# EAGLE design Board (EAGLE 9.3.0)

## Sheet 1 of 2
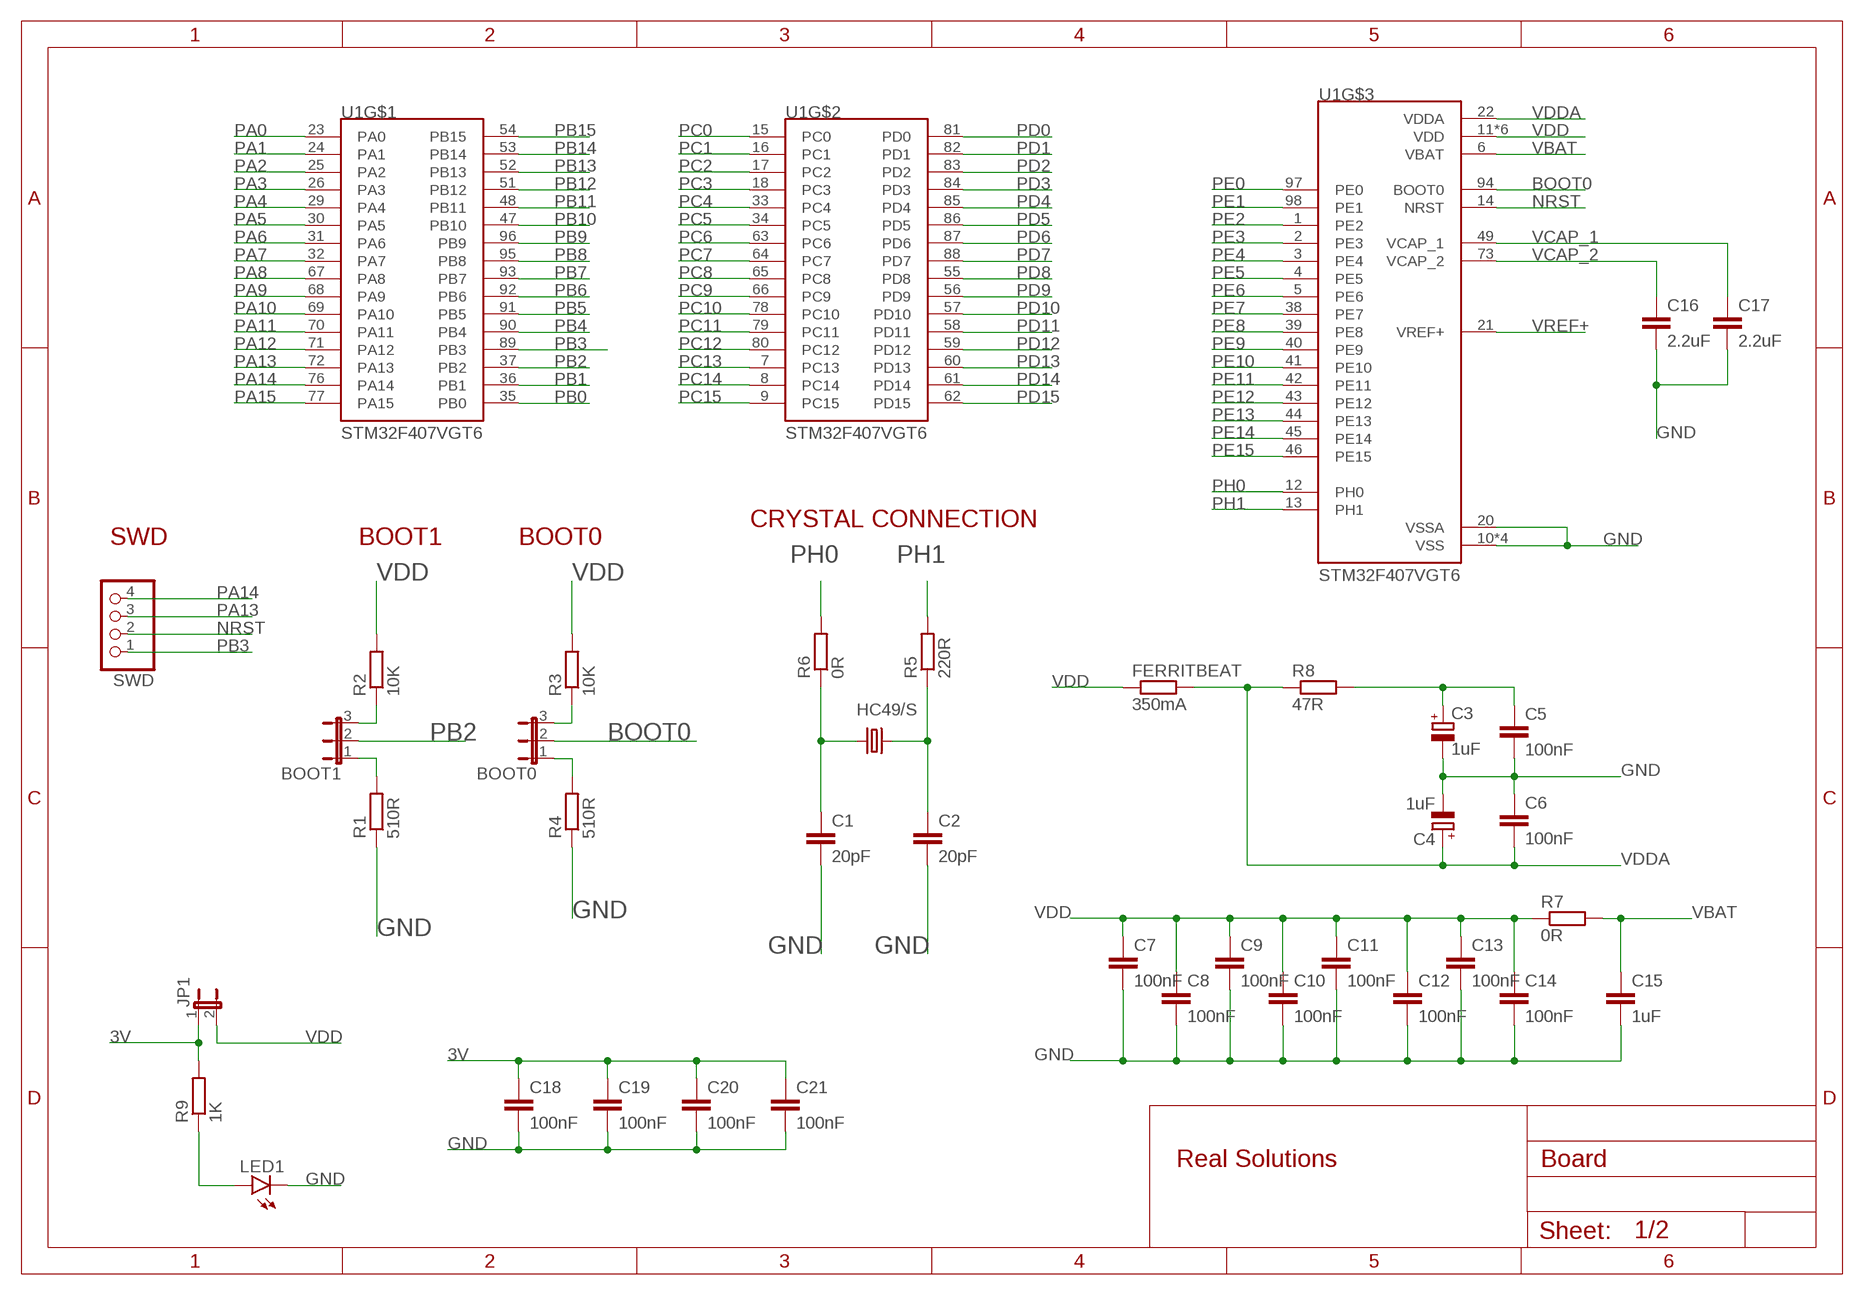
[diagram p0: schematic, sheet 1]

### Parts
BOOT0  JP2E  [JP2]
BOOT1  JP2E  [JP2]
C1  20pF  C-EUC0805  [C0805]
C2  20pF  C-EUC0805  [C0805]
C3  1uF  CPOL-EUSMCA  [SMC_A]
C4  1uF  CPOL-EUSMCA  [SMC_A]
C5  100nF  C-EUC0805  [C0805]
C6  100nF  C-EUC0805  [C0805]
C7  100nF  C-EUC0805  [C0805]
C8  100nF  C-EUC0805  [C0805]
C9  100nF  C-EUC0805  [C0805]
C10  100nF  C-EUC0805  [C0805]
C11  100nF  C-EUC0805  [C0805]
C12  100nF  C-EUC0805  [C0805]
C13  100nF  C-EUC0805  [C0805]
C14  100nF  C-EUC0805  [C0805]
C15  1uF  C-EUC0805  [C0805]
C16  2.2uF  C-EUC0805  [C0805]
C17  2.2uF  C-EUC0805  [C0805]
C18  100nF  C-EUC0805  [C0805]
C19  100nF  C-EUC0805  [C0805]
C20  100nF  C-EUC0805  [C0805]
C21  100nF  C-EUC0805  [C0805]
FERRITBEAT  350mA  R-EU_R1206  [R1206]
HC49/S  CRYSTALHC49S  [HC49/S]
JP1  JP1E  [JP1]
LED1  LEDCHIP-LED0805  [CHIP-LED0805]
R1  510R  R-EU_R0805  [R0805]
R2  10K  R-EU_R0805  [R0805]
R3  10K  R-EU_R0805  [R0805]
R4  510R  R-EU_R0805  [R0805]
R5  220R  R-EU_R0805  [R0805]
R6  0R  R-EU_R0805  [R0805]
R7  0R  R-EU_R0805  [R0805]
R8  47R  R-EU_R0805  [R0805]
R9  1K  R-EU_R0805  [R0805]
SWD  PINHD-1X4  [1X04]
U1  STM32F407VGT6  [QFP50P1600X1600X160-100N]

### Nets
3V: C18.1 C19.1 C20.1 C21.1 JP1.1 R9.2 ; also sheet 2
BOOT0: BOOT0.2 U1.94(BOOT0)
GND: C1.2 C2.2 C3.- C4.- C5.2 C6.1 C7.2 C8.2 C9.2 C10.2 C11.2 C12.2 C13.2 C14.2 C15.2 C16.2 C17.2 C18.2 C19.2 C20.2 C21.2 LED1.C R1.1 R4.1 U1.10(VSS) U1.20(VSSA) U1.27(VSS) U1.74(VSS) U1.99(VSS) ; also sheet 2
N$1: C1.1 HC49/S.1 R6.1
N$2: C2.1 HC49/S.2 R5.1
N$3: BOOT1.3 R2.1
N$4: BOOT1.1 R1.2
N$5: BOOT0.3 R3.1
N$6: BOOT0.1 R4.2
N$7: LED1.A R9.1
N$8: C3.+ C5.1 R8.2
NRST: SWD.2 U1.14(NRST) ; also sheet 2
PA0: U1.23(PA0) ; also sheet 2
PA1: U1.24(PA1) ; also sheet 2
PA2: U1.25(PA2) ; also sheet 2
PA3: U1.26(PA3) ; also sheet 2
PA4: U1.29(PA4) ; also sheet 2
PA5: U1.30(PA5) ; also sheet 2
PA6: U1.31(PA6) ; also sheet 2
PA7: U1.32(PA7) ; also sheet 2
PA8: U1.67(PA8) ; also sheet 2
PA9: U1.68(PA9) ; also sheet 2
PA10: U1.69(PA10) ; also sheet 2
PA11: U1.70(PA11) ; also sheet 2
PA12: U1.71(PA12) ; also sheet 2
PA13: SWD.3 U1.72(PA13) ; also sheet 2
PA14: SWD.4 U1.76(PA14) ; also sheet 2
PA15: U1.77(PA15) ; also sheet 2
PB0: U1.35(PB0) ; also sheet 2
PB1: U1.36(PB1) ; also sheet 2
PB2: BOOT1.2 U1.37(PB2) ; also sheet 2
PB3: SWD.1 U1.89(PB3) ; also sheet 2
PB4: U1.90(PB4) ; also sheet 2
PB5: U1.91(PB5) ; also sheet 2
PB6: U1.92(PB6) ; also sheet 2
PB7: U1.93(PB7) ; also sheet 2
PB8: U1.95(PB8) ; also sheet 2
PB9: U1.96(PB9) ; also sheet 2
PB10: U1.47(PB10) ; also sheet 2
PB11: U1.48(PB11) ; also sheet 2
PB12: U1.51(PB12) ; also sheet 2
PB13: U1.52(PB13) ; also sheet 2
PB14: U1.53(PB14) ; also sheet 2
PB15: U1.54(PB15) ; also sheet 2
PC0: U1.15(PC0) ; also sheet 2
PC1: U1.16(PC1) ; also sheet 2
PC2: U1.17(PC2) ; also sheet 2
PC3: U1.18(PC3) ; also sheet 2
PC4: U1.33(PC4) ; also sheet 2
PC5: U1.34(PC5) ; also sheet 2
PC6: U1.63(PC6) ; also sheet 2
PC7: U1.64(PC7) ; also sheet 2
PC8: U1.65(PC8) ; also sheet 2
PC9: U1.66(PC9) ; also sheet 2
PC10: U1.78(PC10) ; also sheet 2
PC11: U1.79(PC11) ; also sheet 2
PC12: U1.80(PC12) ; also sheet 2
PC13: U1.7(PC13) ; also sheet 2
PC14: U1.8(PC14) ; also sheet 2
PC15: U1.9(PC15) ; also sheet 2
PD0: U1.81(PD0) ; also sheet 2
PD1: U1.82(PD1) ; also sheet 2
PD2: U1.83(PD2) ; also sheet 2
PD3: U1.84(PD3) ; also sheet 2
PD4: U1.85(PD4) ; also sheet 2
PD5: U1.86(PD5) ; also sheet 2
PD6: U1.87(PD6) ; also sheet 2
PD7: U1.88(PD7) ; also sheet 2
PD8: U1.55(PD8) ; also sheet 2
PD9: U1.56(PD9) ; also sheet 2
PD10: U1.57(PD10) ; also sheet 2
PD11: U1.58(PD11) ; also sheet 2
PD12: U1.59(PD12) ; also sheet 2
PD13: U1.60(PD13) ; also sheet 2
PD14: U1.61(PD14) ; also sheet 2
PD15: U1.62(PD15) ; also sheet 2
PE0: U1.97(PE0) ; also sheet 2
PE1: U1.98(PE1) ; also sheet 2
PE2: U1.1(PE2) ; also sheet 2
PE3: U1.2(PE3) ; also sheet 2
PE4: U1.3(PE4) ; also sheet 2
PE5: U1.4(PE5) ; also sheet 2
PE6: U1.5(PE6) ; also sheet 2
PE7: U1.38(PE7) ; also sheet 2
PE8: U1.39(PE8) ; also sheet 2
PE9: U1.40(PE9) ; also sheet 2
PE10: U1.41(PE10) ; also sheet 2
PE11: U1.42(PE11) ; also sheet 2
PE12: U1.43(PE12) ; also sheet 2
PE13: U1.44(PE13) ; also sheet 2
PE14: U1.45(PE14) ; also sheet 2
PE15: U1.46(PE15) ; also sheet 2
PH0: R6.2 U1.12(PH0)
PH1: R5.2 U1.13(PH1)
VBAT: C15.1 R7.2 U1.6(VBAT)
VCAP_1: C17.1 U1.49(VCAP_1)
VCAP_2: C16.1 U1.73(VCAP_2)
VDD: C7.1 C8.1 C9.1 C10.1 C11.1 C12.1 C13.1 C14.1 FERRITBEAT.1 JP1.2 R2.2 R3.2 R7.1 U1.11(VDD) U1.19(VDD) U1.28(VDD) U1.50(VDD) U1.75(VDD) U1.100(VDD) ; also sheet 2
VDDA: C4.+ C6.2 FERRITBEAT.2 R8.1 U1.22(VDDA)
VREF+: U1.21(VREF+)

### Notes on the sheet
- CRYSTAL CONNECTION
- SWD | BOOT1 | BOOT0
- Real Solutions

## Sheet 2 of 2
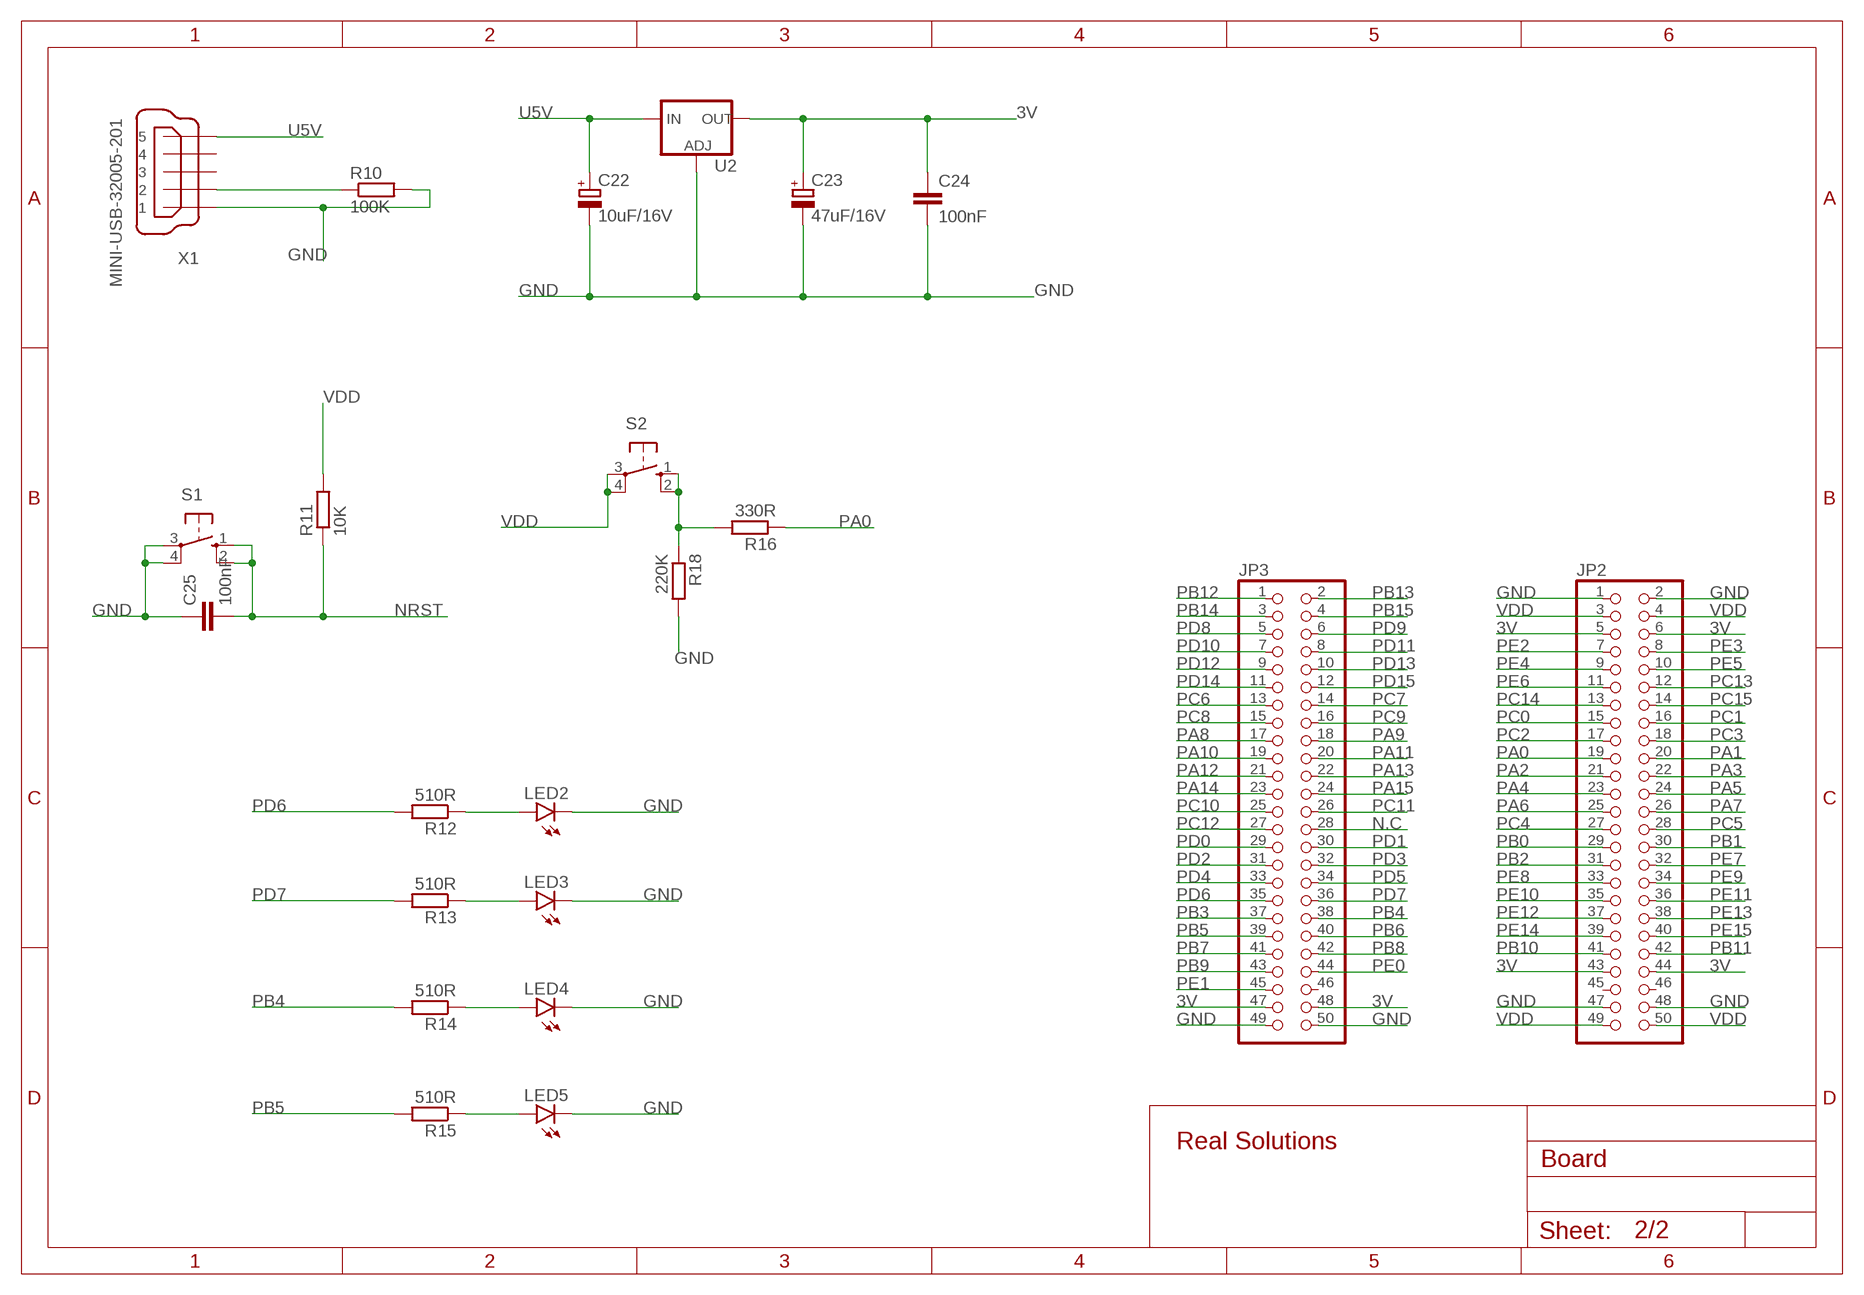
[diagram p1: schematic, sheet 2]

### Parts
C22  10uF/16V  CPOL-EU153CLV-0405  [153CLV-0405]
C23  47uF/16V  CPOL-EU153CLV-0605  [153CLV-0605]
C24  100nF  C-EUC0805  [C0805]
C25  100nF  C-EUC0805  [C0805]
JP2  PINHD-2X25  [2X25]
JP3  PINHD-2X25  [2X25]
LED2  LEDCHIP-LED0805  [CHIP-LED0805]
LED3  LEDCHIP-LED0805  [CHIP-LED0805]
LED4  LEDCHIP-LED0805  [CHIP-LED0805]
LED5  LEDCHIP-LED0805  [CHIP-LED0805]
R10  100K  R-EU_R0805  [R0805]
R11  10K  R-EU_R0805  [R0805]
R12  510R  R-EU_R0805  [R0805]
R13  510R  R-EU_R0805  [R0805]
R14  510R  R-EU_R0805  [R0805]
R15  510R  R-EU_R0805  [R0805]
R16  330R  R-EU_R0805  [R0805]
R18  220K  R-EU_R0805  [R0805]
S1  10-XX  [B3F-10XX]
S2  10-XX  [B3F-10XX]
U2  V_REG_LM1117SOT223  [SOT223]
X1  MINI-USB-32005-201  [32005-201]

### Nets
3V: C23.+ C24.1 JP2.5 JP2.6 JP2.43 JP2.44 JP3.47 JP3.48 U2.2(OUT) U2.4(OUT) ; also sheet 1
GND: C22.- C23.- C24.2 C25.1 JP2.1 JP2.2 JP2.47 JP2.48 JP3.49 JP3.50 LED2.C LED3.C LED4.C LED5.C R10.2 R18.2 S1.3(P) S1.4(P1) U2.1(ADJ) X1.1 ; also sheet 1
N$9: LED2.A R12.1
N$10: LED3.A R13.1
N$11: LED4.A R14.1
N$12: R10.1 X1.2
N$13: LED5.A R15.1
N$15: R16.2 R18.1 S2.1(S) S2.2(S1)
N.C: JP3.28
NRST: C25.2 R11.1 S1.1(S) S1.2(S1) ; also sheet 1
PA0: JP2.19 R16.1 ; also sheet 1
PA1: JP2.20 ; also sheet 1
PA2: JP2.21 ; also sheet 1
PA3: JP2.22 ; also sheet 1
PA4: JP2.23 ; also sheet 1
PA5: JP2.24 ; also sheet 1
PA6: JP2.25 ; also sheet 1
PA7: JP2.26 ; also sheet 1
PA8: JP3.17 ; also sheet 1
PA9: JP3.18 ; also sheet 1
PA10: JP3.19 ; also sheet 1
PA11: JP3.20 ; also sheet 1
PA12: JP3.21 ; also sheet 1
PA13: JP3.22 ; also sheet 1
PA14: JP3.23 ; also sheet 1
PA15: JP3.24 ; also sheet 1
PB0: JP2.29 ; also sheet 1
PB1: JP2.30 ; also sheet 1
PB2: JP2.31 ; also sheet 1
PB3: JP3.37 ; also sheet 1
PB4: JP3.38 R14.2 ; also sheet 1
PB5: JP3.39 R15.2 ; also sheet 1
PB6: JP3.40 ; also sheet 1
PB7: JP3.41 ; also sheet 1
PB8: JP3.42 ; also sheet 1
PB9: JP3.43 ; also sheet 1
PB10: JP2.41 ; also sheet 1
PB11: JP2.42 ; also sheet 1
PB12: JP3.1 ; also sheet 1
PB13: JP3.2 ; also sheet 1
PB14: JP3.3 ; also sheet 1
PB15: JP3.4 ; also sheet 1
PC0: JP2.15 ; also sheet 1
PC1: JP2.16 ; also sheet 1
PC2: JP2.17 ; also sheet 1
PC3: JP2.18 ; also sheet 1
PC4: JP2.27 ; also sheet 1
PC5: JP2.28 ; also sheet 1
PC6: JP3.13 ; also sheet 1
PC7: JP3.14 ; also sheet 1
PC8: JP3.15 ; also sheet 1
PC9: JP3.16 ; also sheet 1
PC10: JP3.25 ; also sheet 1
PC11: JP3.26 ; also sheet 1
PC12: JP3.27 ; also sheet 1
PC13: JP2.12 ; also sheet 1
PC14: JP2.13 ; also sheet 1
PC15: JP2.14 ; also sheet 1
PD0: JP3.29 ; also sheet 1
PD1: JP3.30 ; also sheet 1
PD2: JP3.31 ; also sheet 1
PD3: JP3.32 ; also sheet 1
PD4: JP3.33 ; also sheet 1
PD5: JP3.34 ; also sheet 1
PD6: JP3.35 R12.2 ; also sheet 1
PD7: JP3.36 R13.2 ; also sheet 1
PD8: JP3.5 ; also sheet 1
PD9: JP3.6 ; also sheet 1
PD10: JP3.7 ; also sheet 1
PD11: JP3.8 ; also sheet 1
PD12: JP3.9 ; also sheet 1
PD13: JP3.10 ; also sheet 1
PD14: JP3.11 ; also sheet 1
PD15: JP3.12 ; also sheet 1
PE0: JP3.44 ; also sheet 1
PE1: JP3.45 ; also sheet 1
PE2: JP2.7 ; also sheet 1
PE3: JP2.8 ; also sheet 1
PE4: JP2.9 ; also sheet 1
PE5: JP2.10 ; also sheet 1
PE6: JP2.11 ; also sheet 1
PE7: JP2.32 ; also sheet 1
PE8: JP2.33 ; also sheet 1
PE9: JP2.34 ; also sheet 1
PE10: JP2.35 ; also sheet 1
PE11: JP2.36 ; also sheet 1
PE12: JP2.37 ; also sheet 1
PE13: JP2.38 ; also sheet 1
PE14: JP2.39 ; also sheet 1
PE15: JP2.40 ; also sheet 1
U5V: C22.+ U2.3(IN) X1.5
VDD: JP2.3 JP2.4 JP2.49 JP2.50 R11.2 S2.3(P) S2.4(P1) ; also sheet 1
Unconnected: JP2.45 JP2.46 JP3.46 X1.3 X1.4

### Notes on the sheet
- Real Solutions

## Library data of the parts
BOOT0 BOOT1 = jumper:JP2E: JUMPER
C1 C2 C5-C21 C24 C25 = rcl:C-EU: CAPACITOR, European symbol; SPICEPREFIX: C
C3 C4 C22 C23 = rcl:CPOL-EU: POLARIZED CAPACITOR, European symbol; SPICEPREFIX: C
FERRITBEAT R1-R16 R18 = rcl:R-EU_: RESISTOR, European symbol; SPICEPREFIX: R
HC49/S = crystal:CRYSTAL: CRYSTAL; OC_FARNELL: 1667008; OC_NEWARK: unknown
JP1 = jumper:JP1E: JUMPER
JP2 JP3 = pinhead:PINHD-2X25: PIN HEADER
LED1-LED5 = led:LED: LED OSRAM: - CHIPLED LG R971, LG N971, LY N971, LG Q971, LY Q971, LO R971, LY R971 LH N974, LH R974 LS Q976, LO Q976, LY Q976 LO Q996 - Hyper CHIPLED LW Q18S LB Q993, LB Q99A, LB R99A - SideLED LS A670, LO A670, LY A670, LG A670, LP A670 LB A673, LV A673, LT A673, LW A673 LH A674 LY A675 LS A676, LA A676, LO A676, LY A676, LW A676 LS A679, LY A679, LG A679 - Hyper Micro SIDELED® LS Y876, LA Y876, LO Y876, LY Y876 LT Y87S - SmartLED LW L88C, LW L88S LB L89C, LB L89S, LG L890 LS L89K, LO L89K, LY L89K LS L896, LA L896, LO L896, LY L896 - TOPLED LS T670, LO T670, LY T670, LG T670, LP T670 LSG T670, LSP T670, LSY T670, LOP T670, LYG T670 LG T671, LOG T671, LSG T671 LB T673, LV T673, LT T673, LW T673 LH T674 LS T676, LA T676, LO T676, LY T676, LB T676, LH T676, LSB T676, LW T676 LB T67C, LV T67C, LT T67C, LS T67K, LO T67K, LY T67K, LW E67C LS E67B, LA E67B, LO E67B, LY E67B, LB E67C, LV E67C, LT E67C LW T67C LS T679, LY T679, LG T679 LS T770, LO T770, LY T770, LG T770, LP T770 LB T773, LV T773, LT T773, LW T773 LH T774 LS E675, LA E675, LY E675, LS T675 LS T776, LA T776, LO T776, LY T776, LB T776 LHGB T686 LT T68C, LB T68C - Hyper Mini TOPLED® LB M676 - Mini TOPLED Santana® LG M470 LS M47K, LO M47K, LY M47K Source: http://www.osram.convergy.de LUXEON: - LUMILED® LXK2-PW12-R00, LXK2-PW12-S00, LXK2-PW14-U00, LXK2-PW14-V00 LXK2-PM12-R00, LXK2-PM12-S00, LXK2-PM14-U00 LXK2-PE12-Q00, LXK2-PE12-R00, LXK2-PE12-S00, LXK2-PE14-T00, LXK2-PE14-U00 LXK2-PB12-K00, LXK2-PB12-L00, LXK2-PB12-M00, LXK2-PB14-N00, LXK2-PB14-P00, LXK2-PB14-Q00 LXK2-PR12-L00, LXK2-PR12-M00, LXK2-PR14-Q00, LXK2-PR14-R00 LXK2-PD12-Q00, LXK2-PD12-R00, LXK2-PD12-S00 LXK2-PH12-R00, LXK2-PH12-S00 LXK2-PL12-P00, LXK2-PL12-Q00, LXK2-PL12-R00 Source: www.luxeon.com KINGBRIGHT: KA-3528ASYC Source: www.kingbright.com
S1 S2 = switch-omron:10-XX: OMRON SWITCH; MPN: B3F-1000; OC_FARNELL: 176432; OC_NEWARK: 36M3542
SWD = pinhead:PINHD-1X4: PIN HEADER
U1 = STM32F407VGT6:STM32F407VGT6: STM32 Series 32-bit 1 MB Flash 192 kB RAM ARM Based Microcontroller - LQFP-100; AVAILABILITY: Unavailable; DESCRIPTION: ARM® Cortex®-M4 STM32F4 Microcontroller IC 32-Bit 168MHz 1MB _1M x 8_ FLASH 100-LQFP _14x14_; MF: STMicroelectronics; MP: STM32F407VGT6; PACKAGE: LQFP-100 STMicroelectronics; PRICE: None
U2 = SparkFun-IC-Power:V_REG_LM1117: Voltage Regulator LM1117 Standard adjustable voltage regulator but in SMD form. Spark Fun Electronics SKU : COM-00595; PROD_ID: VREG-08170
X1 = con-cypressindustries:MINI-USB-: MINI USB-B Conector Source: www.cypressindustries.com; OC_FARNELL: unknown; OC_NEWARK: unknown

## Board
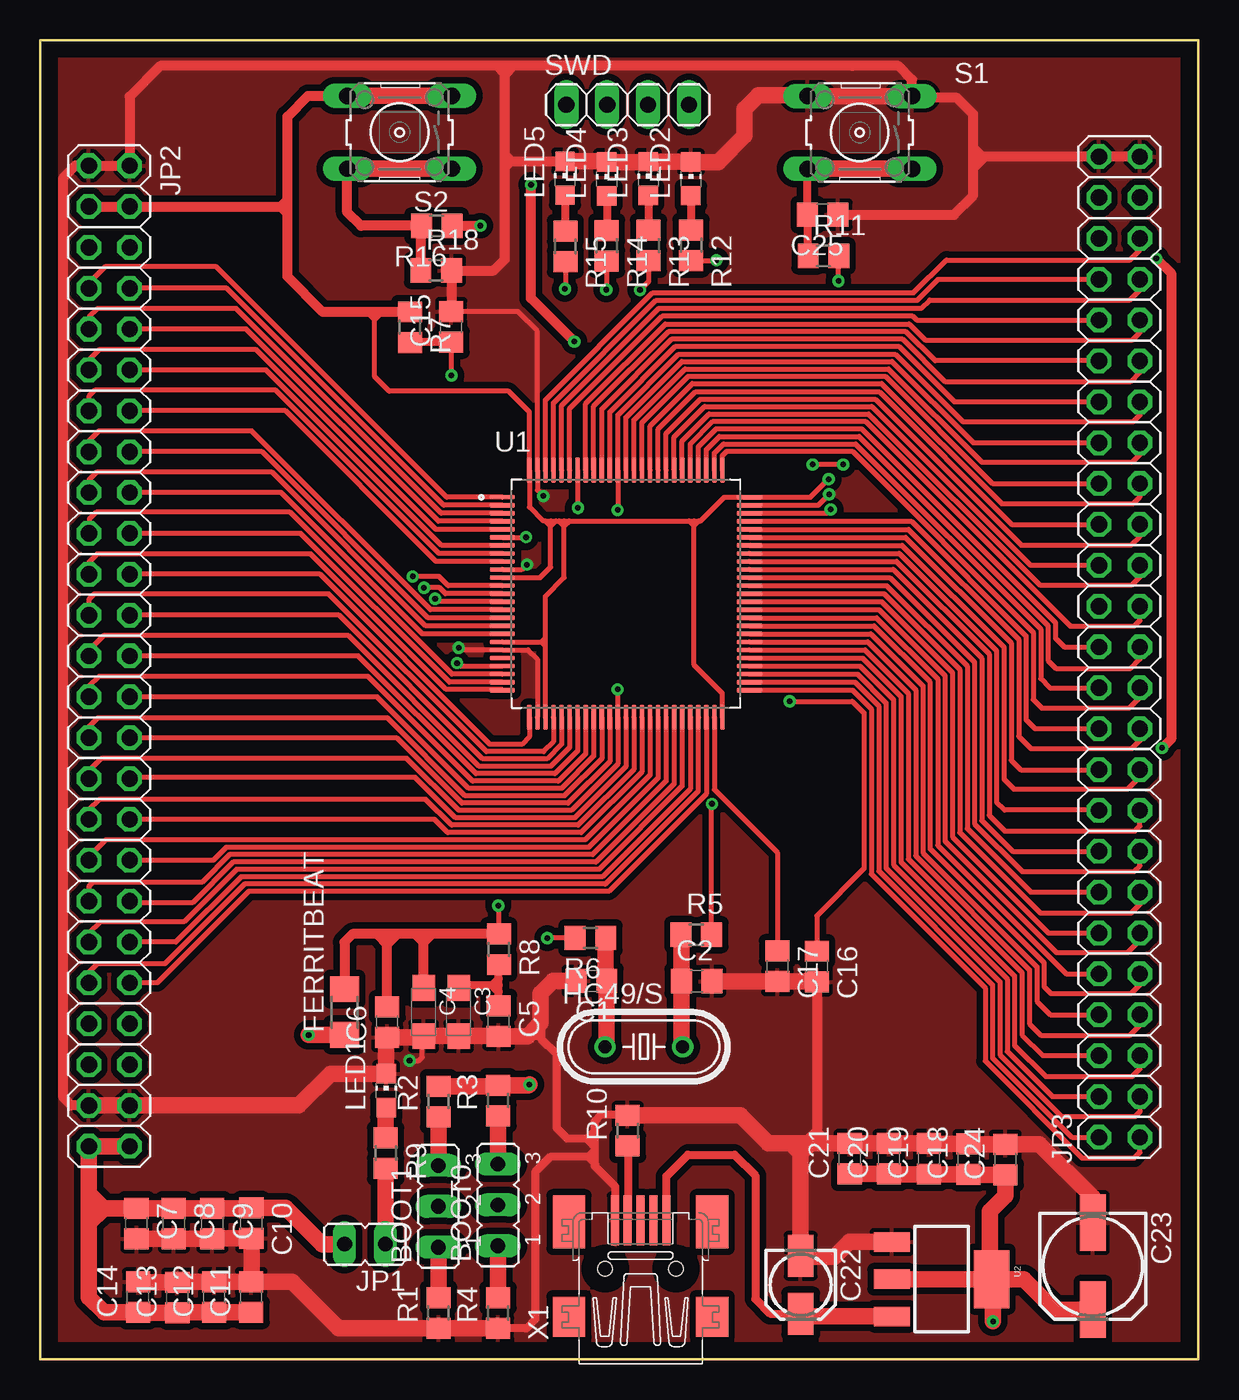
[diagram p2: board, top side]
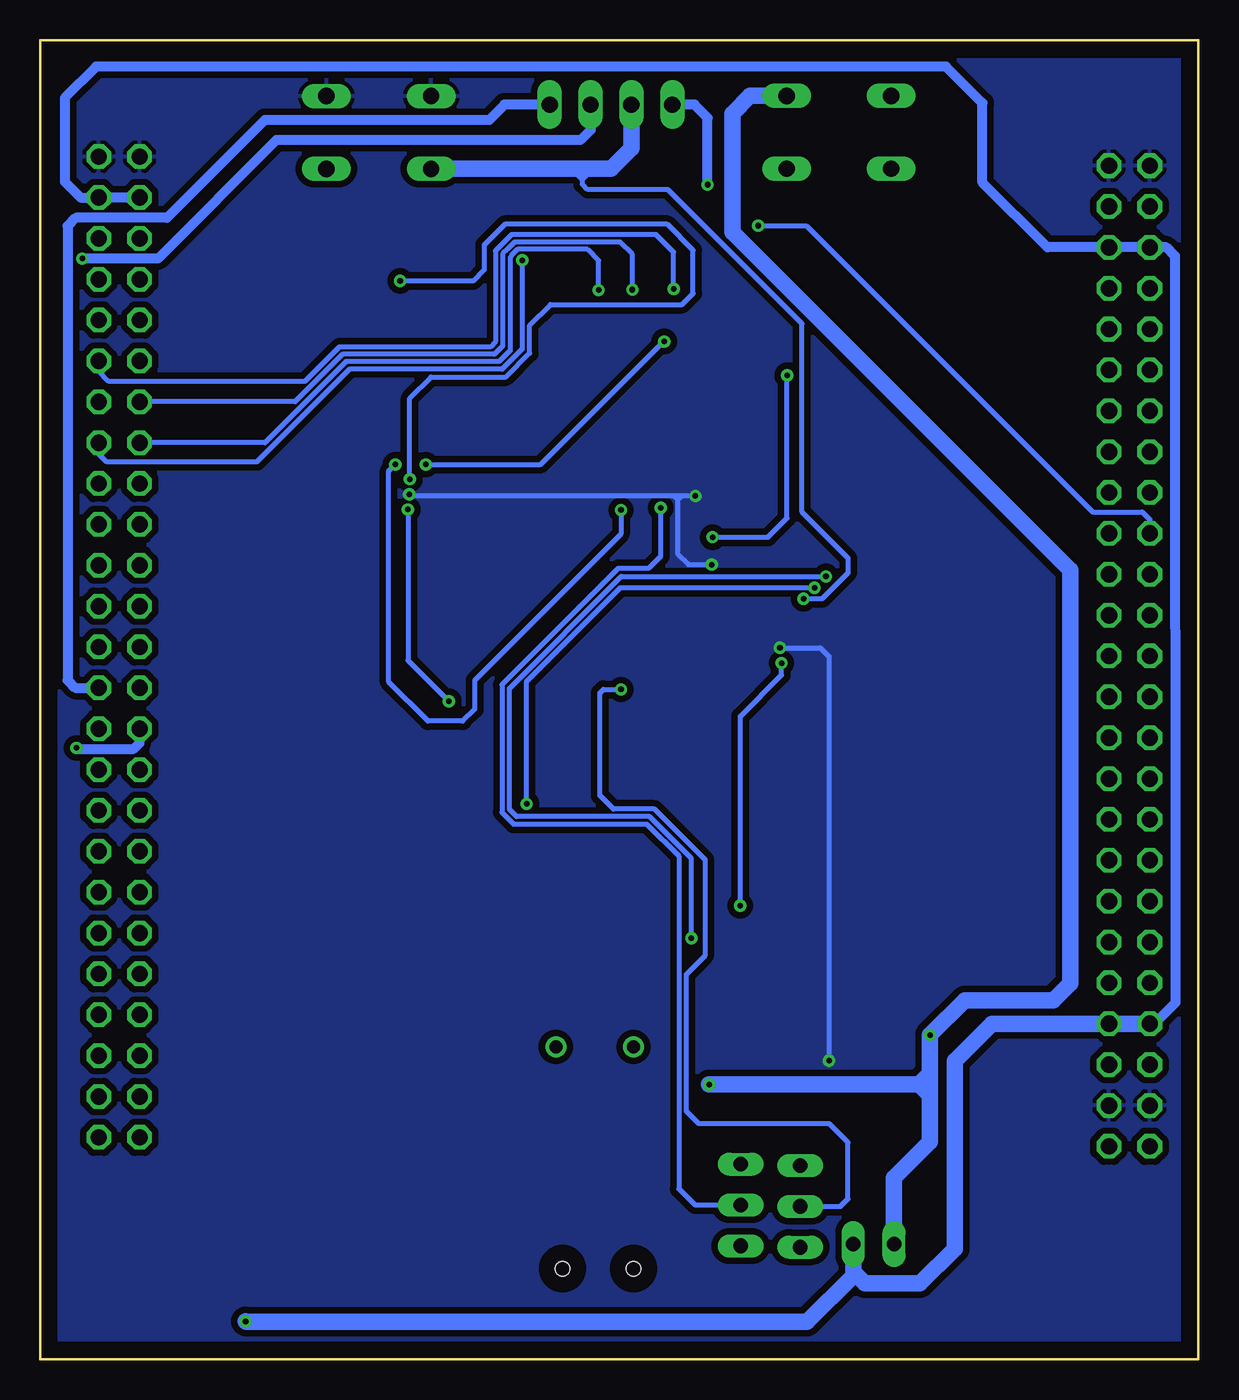
[diagram p3: board, bottom side, seen from below]

Size 72 x 82 mm. Coordinates in mm from the lower left corner, seen from the top.
Outline: 0,0 72,0 72,82 0,82 0,0
Copper layers (1*16): Top 0.035mm / dielectric 1.5mm / Bottom 0.035mm
Design rules "default": minimum track width 6mil, minimum drill 0.35mm, track to track 6mil, track to pad 6mil, pad to pad 6mil, via to via 6mil, smd to smd 6mil, copper to edge 40mil, drill to drill 6mil, minimum pad ring 10mil, minimum via ring 8mil, stop-mask expansion 4mil, vias tented up to drill 0mil, thermal gap 10mil

### Footprints (pad centres in the part's own frame; a part is rotated, then mirrored left to right if it is on the bottom)
JP2 = drill 0.914 long: 1 -2.54,0; 2 0,0; 3 2.54,0
C0805 = smd 1.3 x 1.5: 1 -0.95,0; 2 0.95,0
SMC_A = smd 1.6 x 1.4: + -1.5,0; - 1.5,0
153CLV-0405 = smd 2.6 x 1.6: + 1.8,0; - -1.8,0
153CLV-0605 = smd 3.5 x 1.6: + 2.7,0; - -2.7,0
R1206 = smd 1.6 x 1.803: 1 -1.422,0; 2 1.422,0
HC49/S = drill 0.813: 1 -2.413,0; 2 2.413,0
JP1 = drill 0.914 long: 1 0,-1.27; 2 0,1.27
2X25 = drill 1.016 octagon: 1 -30.48,-1.27; 2 -30.48,1.27; 3 -27.94,-1.27; 4 -27.94,1.27; 5 -25.4,-1.27; 6 -25.4,1.27; 7 -22.86,-1.27; 8 -22.86,1.27; 9 -20.32,-1.27; 10 -20.32,1.27; 11 -17.78,-1.27; 12 -17.78,1.27; 13 -15.24,-1.27; 14 -15.24,1.27; 15 -12.7,-1.27; 16 -12.7,1.27; 17 -10.16,-1.27; 18 -10.16,1.27; 19 -7.62,-1.27; 20 -7.62,1.27; 21 -5.08,-1.27; 22 -5.08,1.27; 23 -2.54,-1.27; 24 -2.54,1.27; 25 0,-1.27; 26 0,1.27; 27 2.54,-1.27; 28 2.54,1.27; 29 5.08,-1.27; 30 5.08,1.27; 31 7.62,-1.27; 32 7.62,1.27; 33 10.16,-1.27; 34 10.16,1.27; 35 12.7,-1.27; 36 12.7,1.27; 37 15.24,-1.27; 38 15.24,1.27; 39 17.78,-1.27; 40 17.78,1.27; 41 20.32,-1.27; 42 20.32,1.27; 43 22.86,-1.27; 44 22.86,1.27; 45 25.4,-1.27; 46 25.4,1.27; 47 27.94,-1.27; 48 27.94,1.27; 49 30.48,-1.27; 50 30.48,1.27
CHIP-LED0805 = smd 1.2 x 1.2: A 0,-1.05; C 0,1.05
R0805 = smd 1.3 x 1.5: 1 -0.95,0; 2 0.95,0
B3F-10XX = drill 1.016 long: 1 -3.251,2.261; 2 3.251,2.261; 3 -3.251,-2.261; 4 3.251,-2.261
1X04 = drill 1.016 long: 1 -3.81,0; 2 -1.27,0; 3 1.27,0; 4 3.81,0
QFP50P1600X1600X160-100N = smd 1.56 x 0.28: 1 -7.68,6; 2 -7.68,5.5; 3 -7.68,5; 4 -7.68,4.5; 5 -7.68,4; 6 -7.68,3.5; 7 -7.68,3; 8 -7.68,2.5; 9 -7.68,2; 10 -7.68,1.5; 11 -7.68,1; 12 -7.68,0.5; 13 -7.68,0; 14 -7.68,-0.5; 15 -7.68,-1; 16 -7.68,-1.5; 17 -7.68,-2; 18 -7.68,-2.5; 19 -7.68,-3; 20 -7.68,-3.5; 21 -7.68,-4; 22 -7.68,-4.5; 23 -7.68,-5; 24 -7.68,-5.5; 25 -7.68,-6; 51 7.68,-6; 52 7.68,-5.5; 53 7.68,-5; 54 7.68,-4.5; 55 7.68,-4; 56 7.68,-3.5; 57 7.68,-3; 58 7.68,-2.5; 59 7.68,-2; 60 7.68,-1.5; 61 7.68,-1; 62 7.68,-0.5; 63 7.68,0; 64 7.68,0.5; 65 7.68,1; 66 7.68,1.5; 67 7.68,2; 68 7.68,2.5; 69 7.68,3; 70 7.68,3.5; 71 7.68,4; 72 7.68,4.5; 73 7.68,5; 74 7.68,5.5; 75 7.68,6 | smd 0.28 x 1.56: 26 -6,-7.68; 27 -5.5,-7.68; 28 -5,-7.68; 29 -4.5,-7.68; 30 -4,-7.68; 31 -3.5,-7.68; 32 -3,-7.68; 33 -2.5,-7.68; 34 -2,-7.68; 35 -1.5,-7.68; 36 -1,-7.68; 37 -0.5,-7.68; 38 0,-7.68; 39 0.5,-7.68; 40 1,-7.68; 41 1.5,-7.68; 42 2,-7.68; 43 2.5,-7.68; 44 3,-7.68; 45 3.5,-7.68; 46 4,-7.68; 47 4.5,-7.68; 48 5,-7.68; 49 5.5,-7.68; 50 6,-7.68; 76 6,7.68; 77 5.5,7.68; 78 5,7.68; 79 4.5,7.68; 80 4,7.68; 81 3.5,7.68; 82 3,7.68; 83 2.5,7.68; 84 2,7.68; 85 1.5,7.68; 86 1,7.68; 87 0.5,7.68; 88 0,7.68; 89 -0.5,7.68; 90 -1,7.68; 91 -1.5,7.68; 92 -2,7.68; 93 -2.5,7.68; 94 -3,7.68; 95 -3.5,7.68; 96 -4,7.68; 97 -4.5,7.68; 98 -5,7.68; 99 -5.5,7.68; 100 -6,7.68
SOT223 = smd 1.219 x 2.235: 1 -2.311,-3.099; 2 0,-3.099; 3 2.311,-3.099 | smd 3.6 x 2.2: 4 0,3.099
32005-201 = smd 3.1 x 0.5: 1 3,1.6; 2 3,0.8; 3 3,0; 4 3,-0.8; 5 3,-1.6 | smd 2.5 x 2: M1 -3,-4.45; M2 -3,4.45 | smd 3.3 x 2: M3 2.9,4.45; M4 2.9,-4.45 | hole 0.9: 0,2.2; 0,-2.2

### Placement (x,y rotation side)
BOOT0  28.45,9.59 90 top
BOOT1  24.75,9.51 90 top
C1  34.27,23.52 180 top
C2  40.81,23.5 0 top
C3  26.02,21.59 270 top
C4  23.83,21.59 270 top
C5  28.5,21.02 270 top
C6  21.57,20.96 90 top
C7  5.99,8.45 270 top
C8  8.31,8.45 270 top
C9  10.7,8.45 270 top
C10  13.13,8.47 270 top
C11  13.11,3.87 90 top
C12  10.81,3.86 90 top
C13  8.53,3.85 90 top
C14  6.08,3.86 90 top
C15  25.55,64.18 90 top
C16  48.28,24.42 270 top
C17  45.83,24.44 270 top
C18  57.71,12.45 90 top
C19  55.25,12.46 90 top
C20  52.76,12.47 90 top
C21  50.32,12.47 90 top
C22  47.28,4.63 270 top
C23  65.44,5.79 270 top
C24  60,12.42 90 top
C25  48.65,71.15 180 top
FERRITBEAT  18.92,21.58 90 top
HC49/S  37.53,19.42 0 top
JP1  20.19,7.16 90 top
JP2  4.29,43.72 270 top
JP3  67.09,44.28 90 top
LED1  21.51,16.7 0 top
LED2  40.45,73.38 0 top
LED3  37.8,73.4 0 top
LED4  35.22,73.38 0 top
LED5  32.63,73.42 0 top
R1  24.76,2.88 90 top
R2  24.77,16.03 90 top
R3  28.46,16.09 90 top
R4  28.46,2.87 90 top
R5  40.79,26.4 0 top
R6  34.21,26.19 180 top
R7  22.99,64.16 270 top
R8  28.52,25.48 270 top
R9  21.47,12.81 270 top
R10  36.52,14.21 90 top
R11  48.69,68.59 0 top
R12  40.46,69.25 270 top
R13  37.82,69.24 270 top
R14  35.21,69.22 270 top
R15  32.65,69.19 270 top
R16  24.65,70.46 180 top
R18  24.61,67.69 0 top
S1  50.95,76.27 180 top
S2  22.34,76.28 180 top
SWD  36.52,77.99 0 top
U1  36.41,47.59 0 top
U2  56.04,4.98 270 top
X1  37.32,5.64 90 top

### Tracks (layer width: path | path; a pad name or v marks a point on that pad's centre or on a via)
3V  (via drill 0.35)
  Top 1.016: C23.+ 63.05,3.09 61.16,4.98 U2.4 | C21.1 C20.1 C19.1 55.26,11.5 C18.1 57.74,11.47 C24.1 60,10.15 59.04,9.19 59.04,5.08 U2.4 | U2.2 U2.4 | JP1.1 21.46,11.85 R9.2 | v59.23,2.35 59.23,4.88 U2.4
  Bottom 0.61: JP2.43 2.73,20.86 1.43,22.16 1.46,68.58 2,69.12 JP2.5 JP2.6 9.39,69.12 13.42,73.16 13.42,78.1 15.69,80.36 68.53,80.36 70.47,78.42 70.47,73.2 69.49,72.22 JP3.47 JP3.48
  Bottom 1.016: JP2.43 JP2.44 12.83,20.86 15.15,18.54 15.15,6.88 17.3,4.73 20.74,4.73 21.46,5.45 JP1.1 21.46,5.18 24.32,2.32 59.2,2.32 v59.23,2.35
BOOT0  (via drill 0.35)
  Top 0.305: U1.94 33.41,52.95 v33.43,52.93
  Bottom 0.305: v33.43,52.93 33.43,49.92 34.18,49.16 36.07,49.16 43.3,41.94 43.3,33.99 42.58,33.28 34.29,33.28 32.3,31.28 32.3,10.59 31.29,9.59 BOOT0.2
GND  (via drill 0.35)
  Top 0.305: U1.27 30.91,43.52 30.34,44.09 U1.20 26.15,44.09 v26.01,44.23 | U1.74 48.37,53.09 v49.05,53.78 | U1.10 29.95,49.09 v30.26,49.4 | v31.27,53.67 30.91,54.03 U1.99 30.91,63.91 29.68,65.14 C15.2 | 54.32,78.41 S1.3 | v22.96,18.56 23.53,18.56 23.75,18.78 23.75,20.01
  Top 0.508: X1.1 35.74,8.65 35.74,10.74 34.49,11.99 34.49,12.17 | R10.2 36.47,15.21 34.9,15.21 34.49,14.8 34.49,14.21 | 34.49,12.17 34.49,12.58 | 34.49,12.58 34.49,12.99 | 34.49,12.99 34.49,13.32 | 34.49,13.32 34.49,13.7 | 34.49,13.7 34.49,14.21 | 34.49,13.7 33.98,13.7 | 33.98,13.7 32.78,13.7 32.12,14.37 32.12,18.95 31.17,19.9 | 31,20.07 30.64,20.43 | 31.17,19.9 31,20.07 | 31,20.07 30.29,20.07 | 31.17,19.9 31.17,20.84 31.11,20.9 | 34.49,12.58 34.08,12.58 | 34.08,12.58 31.7,12.58 30.77,11.65 30.77,2.48 30.22,1.92 R4.1 | 34.08,12.58 34.49,12.99 | 34.08,12.58 34.49,12.17 | 33.98,13.7 34.36,13.32 34.49,13.32 | 33.98,13.7 34.49,14.21
  Top 0.61: C15.2 25.56,65.15 R18.2 28.2,67.69 28.89,68.39 28.89,74.1 | JP2.47 1.92,15.78 1.43,16.27 1.44,73.45 2.19,74.2 JP2.1 JP2.2 5.56,78.49 7.47,80.4 28.39,80.4 | C25.1 56.81,71.15 58.01,72.35 58.01,74.04 | 54.32,78.41 57,78.41 58.01,77.41 58.01,75.32 | 58.01,74.04 58.01,74.71 | 58.01,74.71 58.01,75.32 | 58.73,74.76 JP3.50 JP3.49 | 58.56,74.76 58.06,74.76 58.01,74.71 | 58.73,74.76 58.56,74.76 | 58.56,74.76 58.01,75.32 | 58.73,74.76 58.01,74.04 | S1.3 54.2,79.56 53.35,80.41 50.49,80.41 50.48,80.4 29.4,80.4 | 29.4,80.4 28.82,80.4 | 28.82,80.4 28.39,80.4 | 29.27,74.47 LED5.C | 28.89,74.1 29.27,74.47 | 28.89,74.1 28.89,74.84 | 28.89,74.84 28.89,79.9 | 28.89,79.9 28.89,80.33 28.82,80.4 | 28.89,79.9 28.39,80.4 | 28.89,79.9 29.4,80.4 | 29.27,74.47 28.89,74.84 | C16.2 48.28,14.21 | 48.28,14.15 48.28,13.52 48.38,13.42 | 48.28,14.21 47.87,13.8 47.87,13.42 | 48.28,14.21 48.28,14.15 | 48.28,14.15 49.01,13.42
  Top 1.016: C23.- 65.44,10.06 62.12,13.37 C24.2 57.74,13.37 C18.2 55.26,13.4 C19.2 C20.2 C21.2 | C21.2 | U2.1 50.3,7.29 49.37,6.36 47.35,6.36 C22.- 47.28,12.83 | 47.87,13.42 48.38,13.42 49.01,13.42 C21.2 | 47.28,12.83 47.87,13.42 | 47.87,13.42 46.68,13.42 | 46.68,13.42 45.28,13.42 43.53,15.16 R10.2 | 47.28,12.83 46.68,13.42 | C7.2 C8.2 C9.2 10.72,7.52 C10.2 13.13,4.84 C11.2 | C11.2 10.82,4.82 C12.2 8.54,4.81 C13.2 6.09,4.8 C14.2 | C11.2 15.67,4.82 18.56,1.93 R1.1 R4.1 | JP2.47 JP2.48 16.08,15.78 18.05,17.75 LED1.C 21.51,19.95 C6.1 23.75,20.01 C4.- C3.- 28.47,20.09 C5.2 30.29,20.07 30.64,20.43 31.11,20.9 31.11,22.74 31.89,23.52 C1.2 | S1.3 S1.4 47.64,78.59 44.65,78.59 43.79,77.72 43.79,76.07 42.15,74.43 LED2.C 40.43,74.45 LED3.C 37.78,74.42 LED4.C 35.18,74.47 LED5.C | C16.2 48.26,23.49 C17.2 41.77,23.49 C2.2
  Bottom 0.305: v30.26,49.4 31.71,49.4 32.35,50.03 32.35,53.45 | v49.05,53.78 48.94,53.67 32.56,53.67 | v31.27,53.67 32.13,53.67 | 32.13,53.67 32.36,53.67 | 32.36,53.67 32.56,53.67 | 32.35,53.45 32.35,53.65 32.36,53.67 | 32.35,53.45 32.13,53.67 | 32.35,53.45 32.56,53.67 | v26.01,44.23 23.5,44.23 22.96,43.69 v22.96,18.57 v22.96,18.56
  pour Top (isolate 0.406): -5,84 75,84 75,-4 5,-4 -5,-4
  pour Bottom (isolate 0.406): -5,86 77,86 77,80 77,-6 63,-6 -8,-6 -8,0 -8,86
N$1
  Top 1.016: R6.1 35.16,23.59 C1.1 35.22,19.53 HC49/S.1
N$2
  Top 1.016: R5.1 39.85,26.38 C2.1 39.85,19.51 HC49/S.2
N$3
  Top 1.016: BOOT1.3 24.75,15.06 R2.1
N$4
  Top 1.016: BOOT1.1 24.75,3.84 R1.2
N$5
  Top 1.016: R3.1 BOOT0.3
N$6
  Top 1.016: BOOT0.1 28.45,3.84 R4.2
N$7
  Top 1.016: R9.1 21.47,15.62 LED1.A
N$8
  Top 0.508: C5.1 28.5,22.85 | 28.5,22.85 28.5,23.25 | 28.5,23.25 28.5,23.66 | 28.5,23.66 28.5,24.51 R8.2 | 28.5,23.25 28.09,23.25 | 28.09,23.25 26.18,23.25 C3.+ | 28.09,23.25 28.5,23.66 | 28.09,23.25 28.5,22.85
N$9
  Top 0.508: LED2.A 40.45,70.21 R12.1
N$10
  Top 0.305: R13.1 37.81,70.2
  Top 0.508: LED3.A 37.8,70.2 37.81,70.2
N$11
  Top 0.305: 35.22,70.19 R14.1
  Top 0.508: LED4.A 35.22,70.19
N$12
  Top 0.508: X1.2 36.54,8.65 36.54,13.24 R10.1
N$13
  Top 0.305: 32.65,72.36 LED5.A
  Top 0.508: R15.1 32.65,72.36
N$15
  Top 0.61: R18.1 23.66,70.43 R16.2 19.93,70.46 19.09,71.3 S2.2
  Top 1.016: S2.1 S2.2
NRST  (via drill 0.35)
  Top 0.305: U1.14 24.73,47.09 v24.55,47.28 | 47.74,71.12 C25.2
  Top 0.508: R11.1 47.74,71.12 | C25.2 S1.2
  Top 1.016: S1.1 S1.2
  Bottom 0.305: v24.55,47.28 23.38,47.28 21.76,48.89 21.76,49.79 24.64,52.68 24.64,64.37 32.99,72.71 37.97,72.71 38.3,73.04 38.3,73.33 | 38.3,73.33 38.3,74.01 | 38.3,73.33 37.62,74.01 | 38.3,73.33 38.97,74.01 39.05,74.01
  Bottom 1.016: SWD.2 35.25,75.29 36.53,74.01 37.62,74.01 38.3,74.01 39.05,74.01 S1.2
PA0  (via drill 0.35)
  Top 0.305: U1.23 25.6,42.59 15.53,52.67 3.49,52.67 3.06,52.23 3.06,51.38 JP2.19
  Top 0.61: R16.1 27.36,70.46 v27.37,70.47
  Bottom 0.305: v27.37,70.47 24.37,70.47 6.57,52.67 3.49,52.67 3.02,52.2 JP2.19
PA1
  Top 0.305: U1.24 25.45,42.09 16.2,51.34 JP2.20
PA2
  Top 0.305: U1.25 28.69,41.64 25.23,41.64 16.81,50.06 3.54,50.06 3.02,49.54 JP2.21
PA3
  Top 0.305: U1.26 30.41,38.7 29.94,38.23 27.96,38.23 17.39,48.8 JP2.22
PA4
  Top 0.305: U1.29 31.91,38.39 31.3,37.78 27.74,37.78 17.94,47.58 3.37,47.58 3.02,47.23 JP2.23
PA5
  Top 0.305: U1.30 32.41,38.24 31.49,37.32 27.51,37.32 18.57,46.26 JP2.24
PA6
  Top 0.305: U1.31 32.91,38.04 31.73,36.86 27.29,36.86 19.17,44.98 3.94,44.98 3.02,44.06 JP2.25
PA7
  Top 0.305: U1.32 33.41,37.82 32,36.4 27.09,36.4 19.77,43.72 JP2.26
PA8
  Top 0.305: U1.67 53.23,49.59 59,43.83 59,33.81 59.96,32.84 68.05,32.84 68.36,33.15 JP3.17
PA9
  Top 0.305: U1.68 53.41,50.09 59.45,44.05 59.45,34.63 59.94,34.14 65.8,34.14 JP3.18
PA10
  Top 0.305: U1.69 53.58,50.59 59.91,44.27 59.91,36.06 60.53,35.45 67.61,35.45 68.36,36.2 JP3.19
PA11
  Top 0.305: U1.70 53.79,51.09 60.37,44.52 60.37,37.24 60.97,36.63 65.8,36.63 JP3.20
PA12
  Top 0.305: U1.71 53.98,51.59 60.83,44.75 60.83,38.72 61.59,37.95 67.86,37.95 68.36,38.45 JP3.21
PA13  (via drill 0.35)
  Top 0.305: U1.72 54.16,52.09 61.28,44.97 61.28,39.76 61.84,39.2 JP3.22
  Top 0.61: v69.38,68.43 70.3,67.51 70.3,38.56 69.75,38.01 v69.74,38.01
  Bottom 0.61: SWD.3 37.79,76.42 38.42,75.78 57.32,75.78 64.68,68.43 v69.38,68.43 | v69.74,38.01 69.67,37.94 66.19,37.94 65.82,38.31 JP3.22
PA14
  Top 0.305: U1.76 42.41,56.17 42.69,56.45 50.48,56.45 61.74,45.19 61.74,41.01 62.26,40.48 67.7,40.48 68.36,41.14 JP3.23
  Bottom 0.61: SWD.4 43.13,77.99 44.09,77.03 58.04,77.03 64.12,70.95 69.79,70.95 70.3,70.45 70.3,42.22 69.82,41.74 JP3.23
PA15
  Top 0.305: U1.77 41.91,56.34 42.48,56.91 50.69,56.91 62.2,45.4 62.2,42.31 62.76,41.74 JP3.24
PB0
  Top 0.305: U1.35 34.91,37.34 32.61,35.04 32.61,35.03 26.43,35.03 21.58,39.88 3.59,39.88 3.02,39.31 JP2.29
PB1
  Top 0.305: U1.36 35.41,37.16 32.82,34.58 26.23,34.58 22.18,38.62 5.58,38.62 JP2.30
PB2  (via drill 0.35)
  Top 0.305: U1.37 35.91,39.72 | 35.91,39.72 35.91,37.01 33.02,34.12 26.03,34.12 22.79,37.36 3.8,37.36 3.02,36.57 JP2.31 | v35.9,41.64 35.9,39.74 35.91,39.72
  Bottom 0.305: BOOT1.2 22.25,9.51 21.78,9.97 21.78,13.48 22.94,14.64 31.05,14.64 31.84,15.43 31.84,23.93 30.65,25.12 30.65,31.05 33.8,34.2 36.37,34.2 37.21,35.04 37.21,41.42 36.99,41.64 v35.9,41.64
PB3  (via drill 0.35)
  Top 0.305: JP3.37 68.36,58.69 67.95,58.28 57.37,58.28 53.16,62.48 39.68,62.48 35.91,58.71 U1.89 35.91,52.81 v35.89,52.8 | v49.92,55.63 v48.03,55.63
  Top 0.61: v33.2,63.27 30.51,65.96 v30.51,73.02
  Bottom 0.305: v35.89,52.8 35.89,51.31 44.99,42.21 44.99,40.41 45.73,39.67 47.89,39.67 50.33,42.11 50.33,55.22 v49.92,55.63 | v48.03,55.63 40.89,55.63 33.25,63.27 v33.2,63.27
  Bottom 0.61: v30.51,73.02 30.51,77.18 31.32,77.99 SWD.1
PB4  (via drill 0.35)
  Top 0.305: U1.90 35.41,58.89 39.46,62.94 53.4,62.94 56.82,59.52 JP3.38 | R14.2 35.21,66.52 v35.19,66.49
  Bottom 0.305: v35.19,66.49 35.19,68.7 35.95,69.46 42.5,69.46 42.94,69.02 | 42.94,69.02 | 42.94,69.02 | 42.94,69.02 43.25,68.72 43.25,63 43.76,62.48 53.19,62.48 56.15,59.52 JP3.38
PB5  (via drill 0.35)
  Top 0.305: U1.91 34.91,59.07 39.24,63.41 53.62,63.41 56.27,60.76 67.76,60.76 68.36,61.36 JP3.39 | R15.2 32.65,66.57 v32.62,66.54
  Bottom 0.305: v32.62,66.54 32.62,68.83 33.7,69.92 42.69,69.92 43.7,68.91 43.7,63.25 44.02,62.94 53.4,62.94 55.55,60.79 67.73,60.79 68.36,61.41 JP3.39
PB6
  Top 0.305: U1.92 34.41,59.24 39.05,63.88 53.83,63.88 55.64,62.07 65.81,62.07 JP3.40
PB7
  Top 0.305: U1.93 33.91,59.41 38.87,64.36 54.02,64.36 55.02,63.36 67.9,63.36 68.36,63.82 JP3.41
PB8
  Top 0.305: U1.95 32.91,59.1 38.66,64.85 54.25,64.85 54.49,64.6 JP3.42
PB9
  Top 0.305: U1.96 32.41,59.29 38.45,65.33 54.78,65.33 55.29,65.85 67.75,65.85 68.36,66.47 JP3.43
PB10
  Top 0.305: U1.47 40.91,39.85 40.91,35.31 35.14,29.54 12.71,29.54 7.75,24.59 3.56,24.59 3.02,24.05 JP2.41
PB11
  Top 0.305: U1.48 41.41,35.15 35.35,29.08 12.97,29.08 7.28,23.4 JP2.42
PB12
  Top 0.305: U1.51 50.5,41.59 51.67,40.43 51.67,30.16 58.74,23.09 58.74,18.54 64.77,12.52 68.03,12.52 68.36,12.85 JP3.1
PB13
  Top 0.305: U1.52 50.66,42.09 52.13,40.62 52.13,30.36 59.2,23.28 59.2,18.73 64.13,13.8 JP3.2
PB14
  Top 0.305: U1.53 50.8,42.59 52.58,40.81 52.58,30.54 59.66,23.47 59.66,18.93 63.49,15.1 68.07,15.1 68.38,15.4 68.38,16.32 JP3.3
PB15
  Top 0.305: U1.54 50.96,43.09 53.04,41.01 53.04,30.73 60.12,23.66 60.12,19.14 62.91,16.34 JP3.4
PC0
  Top 0.305: U1.15 24.27,46.59 13.16,57.7 3.65,57.7 3.02,57.07 JP2.15
PC1
  Top 0.305: U1.16 24.11,46.09 13.79,56.42 JP2.16
PC2
  Top 0.305: U1.17 23.96,45.59 14.4,55.15 3.51,55.15 3.02,54.66 JP2.17
PC3
  Top 0.305: U1.18 23.76,45.09 14.97,53.88 JP2.18
PC4
  Top 0.305: U1.33 33.91,37.64 32.22,35.95 26.88,35.95 20.38,42.45 3.66,42.45 3.02,41.81 JP2.27
PC5
  Top 0.305: U1.34 34.41,37.49 32.41,35.49 26.64,35.49 20.95,41.18 JP2.28
PC6
  Top 0.305: U1.63 52.46,47.59 57.17,42.88 57.17,32.75 62.18,27.73 67.82,27.73 68.36,28.28 JP3.13
PC7
  Top 0.305: U1.64 52.62,48.09 57.62,43.09 57.62,33 61.58,29.04 JP3.14
PC8
  Top 0.305: U1.65 52.82,48.59 58.08,43.33 58.08,33.28 61.05,30.31 67.99,30.31 68.36,30.68 JP3.15
PC9
  Top 0.305: U1.66 53.02,49.09 58.54,43.58 58.54,33.49 60.45,31.58 JP3.16
PC10
  Top 0.305: U1.78 41.41,56.55 42.22,57.36 50.9,57.36 62.65,45.61 62.65,43.45 63.15,42.96 67.8,42.96 68.36,43.52 JP3.25
PC11
  Top 0.305: U1.79 40.91,56.73 42.04,57.86 51.05,57.86 63.11,45.8 63.11,44.83 63.66,44.28 JP3.26
PC12
  Top 0.305: U1.80 40.41,56.88 41.84,58.31 51.28,58.31 64.03,45.57 68.01,45.57 68.36,45.92 JP3.27
PC13
  Top 0.305: U1.7 24.96,50.59 14.05,61.5 JP2.12
PC14
  Top 0.305: U1.8 24.79,50.09 14.64,60.24 3.39,60.24 3.02,59.87 JP2.13
PC15
  Top 0.305: U1.9 24.61,49.59 15.24,58.96 JP2.14
PD0
  Top 0.305: U1.81 39.91,57.09 41.59,58.77 51.5,58.77 62.14,48.13 67.88,48.13 68.36,48.62 JP3.29
PD1
  Top 0.305: U1.82 39.41,57.33 41.31,59.23 51.7,59.23 61.57,49.36 JP3.30
PD2
  Top 0.305: U1.83 38.91,57.55 41.04,59.69 51.92,59.69 60.99,50.61 67.81,50.61 68.36,51.16 JP3.31
PD3
  Top 0.305: U1.84 38.41,57.81 40.74,60.14 52.16,60.14 60.4,51.9 JP3.32
PD4
  Top 0.305: U1.85 37.91,58.02 40.54,60.65 52.31,60.65 59.77,53.19 67.95,53.19 68.36,53.6 JP3.33
PD5
  Top 0.305: U1.86 37.41,58.22 40.3,61.11 52.53,61.11 59.2,54.44 JP3.34
PD6  (via drill 0.35)
  Top 0.305: U1.87 36.91,58.39 40.09,61.57 52.74,61.57 58.55,55.76 67.89,55.76 68.36,56.23 JP3.35 | R12.2 42.02,68.3 v42.03,68.32
  Bottom 0.305: v42.03,68.32 42.03,62.78 43.27,61.54 52.77,61.54 58.54,55.77 67.86,55.77 68.36,56.27 JP3.35
PD7  (via drill 0.35)
  Top 0.305: U1.88 36.41,58.55 39.89,62.02 52.95,62.02 58,56.98 JP3.36 | R13.2 37.82,67 v37.29,66.47
  Bottom 0.305: v37.29,66.47 37.29,68.3 37.99,69 42.31,69 42.72,68.6 42.72,68.56 42.79,68.49 42.79,62.7 43.47,62.02 52.98,62.02 58.02,56.98 JP3.36
PD8
  Top 0.305: U1.55 51.12,43.59 53.51,41.2 53.51,30.91 60.57,23.85 60.57,19.51 62.51,17.58 67.88,17.58 68.36,18.05 JP3.5
PD9
  Top 0.305: U1.56 51.27,44.09 53.97,41.4 53.97,31.1 61.03,24.04 61.03,20.18 62.33,18.88 JP3.6
PD10
  Top 0.305: U1.57 51.44,44.59 54.42,41.61 54.42,31.29 61.5,24.21 61.5,20.86 62.22,20.14 67.74,20.14 68.36,20.76 JP3.7
PD11
  Top 0.305: U1.58 51.64,45.09 54.88,41.85 54.88,31.48 61.96,24.4 61.96,22.26 62.8,21.42 JP3.8
PD12
  Top 0.305: U1.59 51.84,45.59 55.34,42.1 55.34,31.72 62.42,24.64 62.42,23.15 62.84,22.72 67.8,22.72 68.36,23.29 JP3.9
PD13
  Top 0.305: U1.60 52,46.09 55.8,42.3 55.8,31.95 63.79,23.96 JP3.10
PD14
  Top 0.305: U1.61 52.15,46.59 56.25,42.49 56.25,32.21 63.18,25.29 67.62,25.29 68.36,26.02 JP3.11
PD15
  Top 0.305: U1.62 52.3,47.09 56.71,42.69 56.71,32.48 62.69,26.5 JP3.12
PE0
  Top 0.305: U1.97 31.91,59.45 38.3,65.83 54.52,65.83 55.83,67.14 JP3.44
PE1
  Top 0.305: U1.98 31.41,59.63 38.08,66.3 54.3,66.3 56.34,68.34 67.75,68.34 68.36,68.95 JP3.45
PE2
  Top 0.305: U1.1 25.27,53.59 10.94,67.92 4.04,67.92 3.02,66.9 JP2.7
PE3
  Top 0.305: U1.2 25.09,53.09 11.6,66.58 JP2.8
PE4
  Top 0.305: U1.3 24.92,52.59 12.19,65.33 3.56,65.33 3.02,64.78 JP2.9
PE5
  Top 0.305: U1.4 24.76,52.09 12.82,64.04 JP2.10
PE6
  Top 0.305: U1.5 24.6,51.59 13.44,62.76 3.66,62.76 3.02,62.12 JP2.11
PE7
  Top 0.305: U1.38 36.41,39.87 36.41,36.84 33.23,33.66 25.83,33.66 23.32,36.17 5.63,36.17 JP2.32
PE8
  Top 0.305: U1.39 36.91,36.68 33.44,33.2 25.58,33.2 23.97,34.81 3.69,34.81 3.02,34.14 JP2.33
PE9
  Top 0.305: U1.40 37.41,36.52 33.63,32.75 25.34,32.75 24.52,33.57 JP2.34
PE10
  Top 0.305: U1.41 37.91,36.33 33.87,32.29 4.08,32.29 3.02,31.23 JP2.35
PE11
  Top 0.305: U1.42 38.41,36.14 34.09,31.83 11.57,31.83 10.77,31.02 JP2.36
PE12
  Top 0.305: U1.43 38.91,35.94 34.34,31.37 11.77,31.37 10.05,29.66 3.27,29.66 3.02,29.41 JP2.37
PE13
  Top 0.305: U1.44 39.41,35.77 34.55,30.91 12,30.91 9.46,28.38 5.67,28.38 JP2.38
PE14
  Top 0.305: U1.45 39.91,35.63 34.74,30.46 12.2,30.46 8.95,27.2 3.76,27.2 3.02,26.47 JP2.39
PE15
  Top 0.305: U1.46 40.41,35.46 34.95,30 12.49,30 8.43,25.94 JP2.40
PH0  (via drill 0.35)
  Top 0.305: U1.12 25.36,48.09 24.79,48.66 v23.16,48.66 v23.16,48.67 | R6.2 31.53,26.19 v31.52,26.18
  Bottom 0.305: v31.52,26.18 31.52,31.15 34.11,33.74 42.4,33.74 42.84,34.18 42.84,41.71 35.88,48.67 v23.16,48.67
PH1  (via drill 0.35)
  Top 0.305: U1.13 25.2,47.59 24.83,47.96 v23.86,47.96 v23.86,47.97 | R5.2 41.73,34.51 v41.76,34.53
  Bottom 0.305: v41.76,34.53 41.76,42.15 35.94,47.97 v23.86,47.97
U5V
  Top 0.508: X1.5 38.92,11.39 40.26,12.72 43.17,12.72 44.45,11.43 44.45,3.75 45.38,2.83 C22.+
  Top 1.016: U2.3 47.44,2.67 C22.+
VBAT  (via drill 0.35)
  Top 0.305: U1.6 30.19,51.09 v30.2,51.1 | v25.57,61.16 25.57,63.22 C15.1
  Top 0.508: C15.1 23.01,63.23 R7.2
  Bottom 0.305: v30.2,51.1 26.75,51.1 25.57,52.29 v25.57,61.16
VCAP_1
  Top 0.305: U1.49 41.91,35.42 45.83,31.5 C17.1
VCAP_2  (via drill 0.35)
  Top 0.305: U1.73 48.91,52.59 v49.14,52.83 | v46.6,40.91 50.49,40.91 51.21,40.18 51.21,30.5 48.28,27.57 C16.1
  Bottom 0.305: v49.14,52.83 49.14,43.45 v46.6,40.91
VDD  (via drill 0.35)
  Top 0.305: 31.41,52.11 31.73,52.11 | 31.73,52.11 32.05,52.11 | 32.26,52.11 32.58,52.11 | 32.58,52.11 32.9,52.11 | 32.9,52.11 40.36,52.11 | 40.36,52.11 40.64,52.11 | 40.64,52.11 40.93,52.11 | U1.11 31.09,48.59 31.73,49.23 31.73,51.79 | 31.73,51.79 31.73,52.11 | U1.28 31.41,44.35 | 31.41,44.35 31.41,44.59 | 31.41,44.59 31.41,44.84 | 31.41,44.84 31.41,47.43 32.58,48.59 32.58,51.79 | 32.58,51.79 32.58,52.11 | U1.50 42.41,41.4 40.64,43.17 40.64,51.83 | 40.64,51.83 40.64,52.11 | 40.64,51.83 40.36,52.11 | 40.64,51.83 40.93,52.11 | 40.93,52.11 41.05,52.11 42.53,53.59 U1.75 47.9,53.59 v49.01,54.71 v49.02,54.71 | 32.58,51.79 32.26,52.11 | 32.58,51.79 32.9,52.11 | 31.73,51.79 32.05,52.11 | 32.05,52.11 32.26,52.11 | 31.73,51.79 31.41,52.11 | 31.41,52.11 31.26,52.11 30.41,52.97 U1.100 30.41,58.88 29.12,60.18 21.7,60.18 20.79,61.08 20.79,64.64 | U1.19 31.16,44.59 | 31.16,44.59 31.4,44.59 31.41,44.59 | 31.16,44.59 31.41,44.84 | 31.16,44.59 31.41,44.35 | 20.76,65.11 20.79,65.08 20.79,64.64 | 20.79,64.64 20.32,65.11 20.28,65.11 | 20.79,64.64 21.21,65.05 21.21,65.11 | v49.63,67.04 49.63,68.58 R11.2
  Top 0.61: R7.1 21.21,65.11 20.76,65.11 20.28,65.11 17.57,65.11 15.37,67.31 15.37,71.23 | 15.37,71.23 15.37,71.63 | 15.37,71.63 15.37,72.09 | 15.37,72.09 15.37,77.26 16.65,78.54 S2.4 | JP2.3 JP2.4 14.94,71.66 | 14.94,71.66 15.34,71.66 15.37,71.63 | 14.94,71.66 15.37,72.09 | 14.94,71.66 15.37,71.23
  Top 1.016: R2.2 28.4,16.98 R3.2 30.37,17.04 v30.41,17.08 | JP1.2 17.51,7.16 15.25,9.42 C10.1 13.11,9.4 C9.1 C8.1 C7.1 3.95,9.4 | C11.1 10.82,2.92 C12.1 8.54,2.91 C13.1 6.09,2.9 C14.1 3.96,2.91 3.02,3.85 3.02,8.47 | 3.02,8.47 3.02,9.39 | 3.02,9.39 3.02,10.32 | 3.02,10.32 JP2.49 JP2.50 | 3.95,9.4 3.03,9.4 3.02,9.39 | 3.95,9.4 3.02,10.32 | 3.95,9.4 3.02,8.47 | S2.3 S2.4 | FERRITBEAT.1 v16.69,20.16
  Bottom 0.305: v49.02,54.71 49.02,59.75 47.7,61.07 43.04,61.07 41.58,62.54 41.58,64.28 40.29,65.57 32.1,65.57 31.41,66.26 31.41,68.95 33.01,70.55 43.11,70.55 44.39,69.27 44.39,67.73 45.09,67.04 v49.63,67.04
  Bottom 1.016: 16.69,17.76 v16.69,20.16 14.53,22.32 9.02,22.32 7.96,23.38 7.96,49.06 28.96,70.06 28.96,77.44 27.87,78.54 S2.3 | 16.69,17.76 16.69,17.09 | 16.69,17.09 16.69,16.4 | 16.69,16.4 16.69,13.52 18.92,11.29 JP1.2 | v30.41,17.08 17.37,17.08 | 17.37,17.08 16.7,17.08 16.69,17.09 | 17.37,17.08 16.69,17.76 | 17.37,17.08 16.69,16.4
VDDA  (via drill 0.35)
  Top 0.305: R8.1 28.52,28.16 v28.48,28.2 | v25.91,43.28 26.1,43.09 U1.22
  Top 0.61: R8.1 24.35,26.43 | 24.35,26.43 23.74,26.43 | 23.74,26.43 23.32,26.43 | 23.32,26.43 22.21,26.43 | 22.21,26.43 21.51,26.43 | 21.51,26.43 20.96,26.43 | 20.96,26.43 19.41,26.43 18.92,25.94 FERRITBEAT.2 | C6.2 21.57,25.79 | 21.57,25.79 21.57,26.37 21.51,26.43 | C4.+ 23.84,25.92 | 23.84,25.92 23.84,26.34 23.74,26.43 | 23.84,25.92 23.32,26.43 | 23.84,25.92 24.35,26.43 | 21.57,25.79 20.96,26.4 20.96,26.43 | 21.57,25.79 22.21,26.43
  Bottom 0.305: v28.48,28.2 28.48,39.97 25.91,42.53 v25.91,43.28